# EAGLE design v2164_quad_VC_mixer_w_ext_in_0402 (EAGLE 7.7.0)
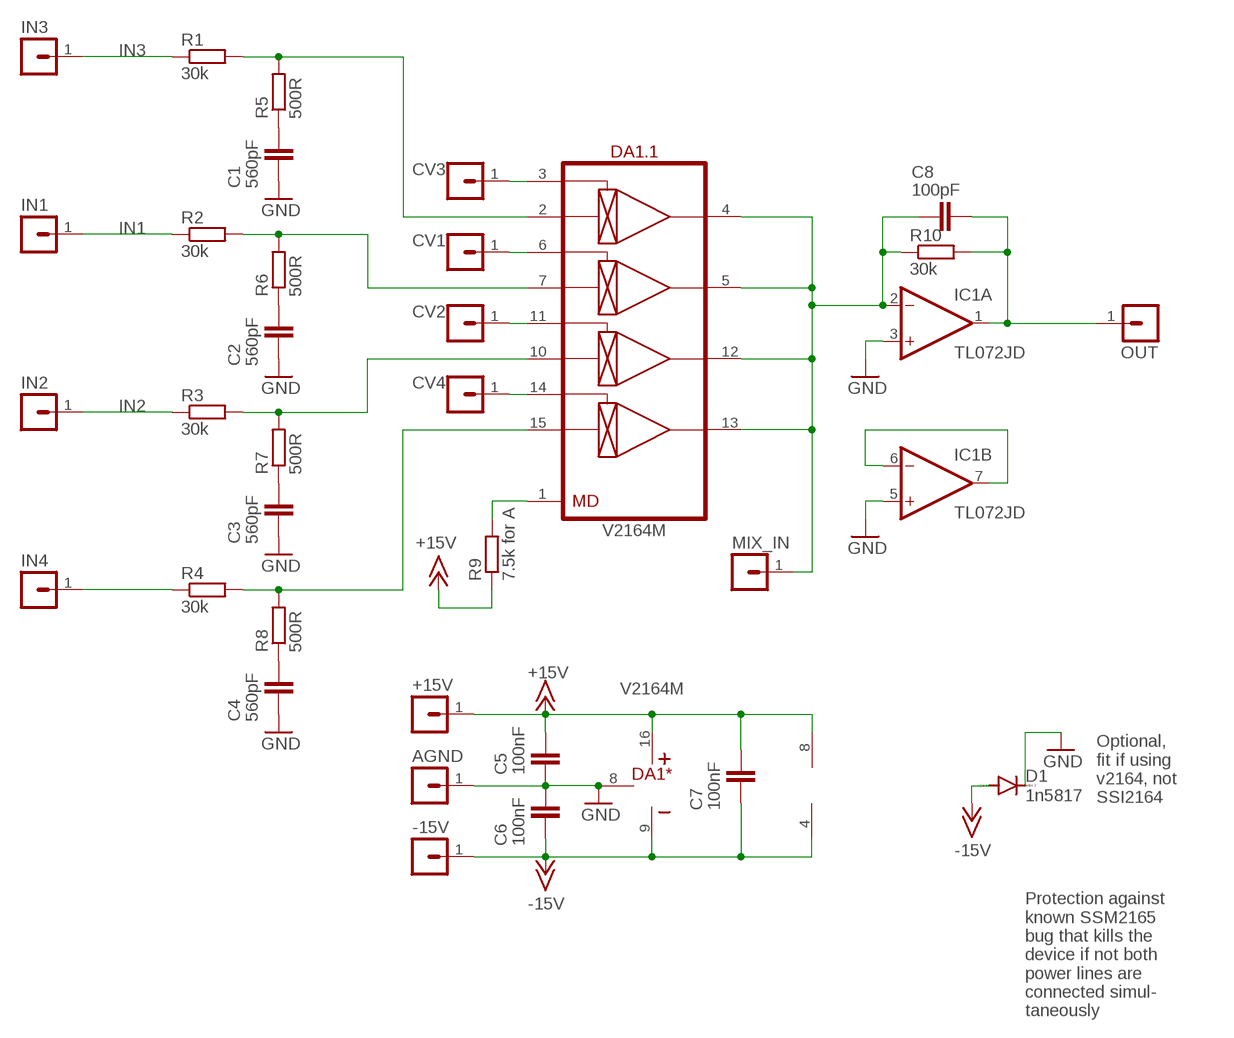
[diagram p0: schematic, sheet 1]

## Parts
+15V  MA01-1JN  [MA01N-1J]
-15V  MA01-1JN  [MA01N-1J]
AGND  MA01-1JN  [MA01N-1J]
C1  560pF  C-EUC0603  [C0603]
C2  560pF  C-EUC0603  [C0603]
C3  560pF  C-EUC0603  [C0603]
C4  560pF  C-EUC0603  [C0603]
C5  100nF  C-EUC0402  [C0402]
C6  100nF  C-EUC0402  [C0402]
C7  100nF  C-EUC0402  [C0402]
C8  100pF  C-EUC0402  [C0402]
CV1  MA01-1JN  [MA01N-1J]
CV2  MA01-1JN  [MA01N-1J]
CV3  MA01-1JN  [MA01N-1J]
CV4  MA01-1JN  [MA01N-1J]
D1  1n5817  DIODE-SOD323-R  [SOD323-R]
DA1  V2164M  [SO-16]
IC1  TL072JD  [SO08J]
IN1  MA01-1JN  [MA01N-1J]
IN2  MA01-1JN  [MA01N-1J]
IN3  MA01-1JN  [MA01N-1J]
IN4  MA01-1JN  [MA01N-1J]
MIX_IN  MA01-1JN  [MA01N-1J]
OUT  MA01-1JN  [MA01N-1J]
R1  30k  R-EU_R0402  [R0402]
R2  30k  R-EU_R0402  [R0402]
R3  30k  R-EU_R0402  [R0402]
R4  30k  R-EU_R0402  [R0402]
R5  500R  R-EU_R0402  [R0402]
R6  500R  R-EU_R0402  [R0402]
R7  500R  R-EU_R0402  [R0402]
R8  500R  R-EU_R0402  [R0402]
R9  7.5k for A  R-EU_R0402  [R0402]
R10  30k  R-EU_R0402  [R0402]

## Nets
+15V: +15V.1 C5.2 C7.2 DA1.16(*:V+) IC1.8(P:V+) R9.1
-15V: -15V.1 C6.1 C7.1 D1.A DA1.9(*:V-) IC1.4(P:V-)
CV1: CV1.1 DA1.6(.1:CV2)
CV2: CV2.1 DA1.11(.1:CV3)
CV4: CV4.1 DA1.14(.1:CV4)
CV5: CV3.1 DA1.3(.1:CV1)
GND: AGND.1 C1.1 C2.1 C3.1 C4.1 C5.1 C6.2 D1.C DA1.8(*:GND) IC1.3(A:+IN) IC1.5(B:+IN)
IN1: IN1.1 R2.1
IN2: IN2.1 R3.1
IN3: IN3.1 R1.1
IN4: IN4.1 R4.1
N$1: IC1.6(B:-IN) IC1.7(B:OUT)
N$2: DA1.1(.1:MD) R9.2
N$5: C8.1 DA1.4(.1:OUT1) DA1.5(.1:OUT2) DA1.12(.1:OUT3) DA1.13(.1:OUT4) IC1.2(A:-IN) MIX_IN.1 R10.1
N$9: C1.2 R5.1
N$10: C2.2 R6.1
N$11: C3.2 R7.1
N$12: C4.2 R8.1
N$17: DA1.2(.1:IN1) R1.2 R5.2
N$18: DA1.7(.1:IN2) R2.2 R6.2
N$19: DA1.10(.1:IN3) R3.2 R7.2
N$20: DA1.15(.1:IN4) R4.2 R8.2
OUT: C8.2 IC1.1(A:OUT) OUT.1 R10.2

## Notes on the sheet
- Optional,
  fit if using
  v2164, not
  SSI2164
- Protection against
  known SSM2165
  bug that kills the
  device if not both
  power lines are 
  connected simul-
  taneously

## Library data of the parts
+15V -15V AGND CV1-CV4 IN1-IN4 MIX_IN OUT = joakim:MA01-1J: PIN HEADER
C1-C8 = rcl:C-EU: CAPACITOR, European symbol; SPICEPREFIX: C
D1 = diode:DIODE-: DIODE
DA1 = ic-coolaudio:V2164
IC1 = joakim:TL072J: OP AMP
R1-R10 = rcl:R-EU_: RESISTOR, European symbol; SPICEPREFIX: R

## Board
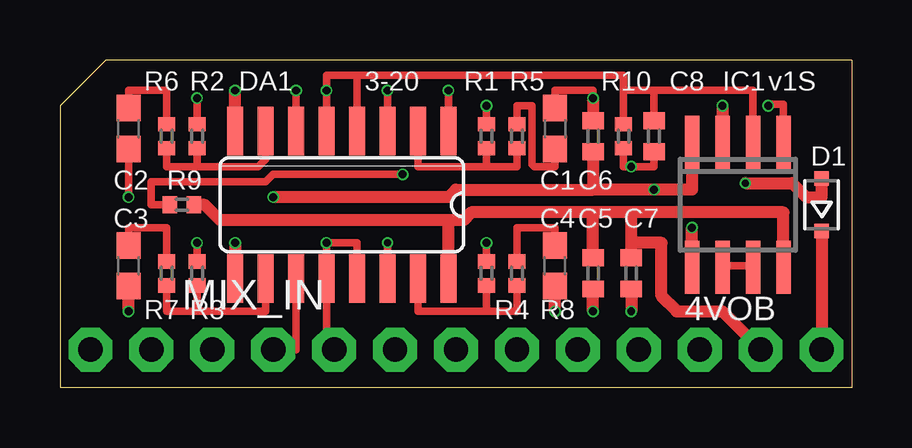
[diagram p1: board, top side]
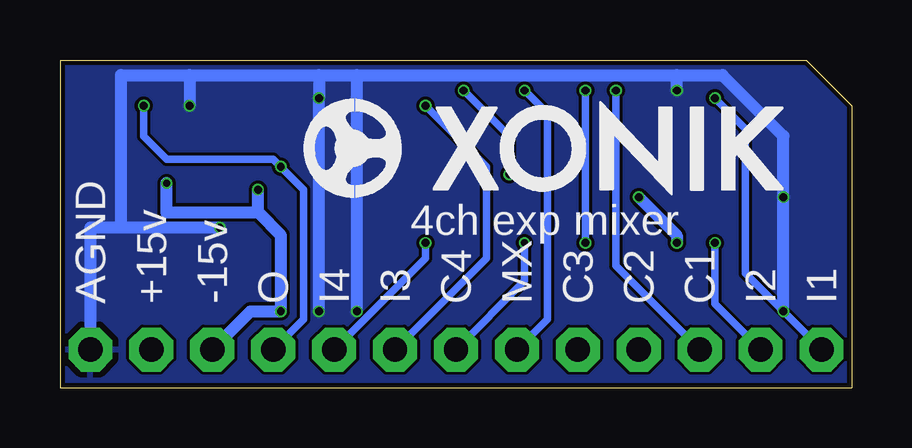
[diagram p2: board, bottom side, seen from below]

Size 33.02 x 13.65 mm. Coordinates in mm from the lower left corner, seen from the top.
Outline: 33.02,13.65 1.91,13.65 0,11.75 0,0 33.02,0 33.02,13.65
Copper layers (1*16): Top 0.035mm / dielectric 1.6mm / Bottom 0.035mm
Design rules "jlcpcb-2layers": minimum track width 5mil, minimum drill 0.3mm, track to track 5mil, track to pad 5mil, pad to pad 5mil, via to via 5mil, smd to smd 5mil, copper to edge 0.2mm, drill to drill 6mil, minimum pad ring 10mil, minimum via ring 3mil, stop-mask expansion 4mil, vias tented up to drill 0mil, thermal gap 10mil

### Footprints (pad centres in the part's own frame; a part is rotated, then mirrored left to right if it is on the bottom)
MA01N-1J = drill 1.016 octagon: 1 0,0
C0603 = smd 1.1 x 1: 1 -0.85,0; 2 0.85,0
C0402 = smd 0.7 x 0.9: 1 -0.65,0; 2 0.65,0
SOD323-R = smd 0.6 x 0.6: A 1.1,0; C -1.1,0
SO-16 = smd 0.66 x 2.032: 1 -4.445,-3.073; 2 -3.175,-3.073; 3 -1.905,-3.073; 4 -0.635,-3.073; 5 0.635,-3.073; 6 1.905,-3.073; 7 3.175,-3.073; 8 4.445,-3.073; 9 4.445,3.073; 10 3.175,3.073; 11 1.905,3.073; 12 0.635,3.073; 13 -0.635,3.073; 14 -1.905,3.073; 15 -3.175,3.073; 16 -4.445,3.073
SO08J = smd 0.6 x 2.2: 1 -1.905,-2.6; 2 -0.635,-2.6; 3 0.635,-2.6; 4 1.905,-2.6; 5 1.905,2.6; 6 0.635,2.6; 7 -0.635,2.6; 8 -1.905,2.6
R0402 = smd 0.6 x 0.7: 1 -0.5,0; 2 0.5,0

### Placement (x,y rotation side)
+15V  29.21,1.59 90 top
-15V  26.67,1.59 90 top
AGND  31.75,1.59 90 top
C1  20.64,10.79 270 top
C2  2.86,10.79 90 top
C3  2.86,5.08 90 top
C4  20.64,5.08 90 top
C5  22.23,4.76 90 top
C6  22.23,10.48 90 top
C7  23.81,4.76 90 top
C8  24.77,10.48 270 top
CV1  6.35,1.59 90 top
CV2  8.89,1.59 90 top
CV3  13.97,1.59 90 top
CV4  16.51,1.59 90 top
D1  31.75,7.62 90 top
DA1  11.75,7.62 180 top
IC1  28.26,7.62 180 top
IN1  1.27,1.59 90 top
IN2  3.81,1.59 90 top
IN3  19.05,1.59 90 top
IN4  21.59,1.59 90 top
MIX_IN  11.43,1.59 0 top
OUT  24.13,1.59 90 top
R1  17.78,10.48 270 top
R2  5.71,10.48 270 top
R3  5.71,4.76 270 top
R4  17.78,4.76 270 top
R5  19.05,10.48 270 top
R6  4.45,10.48 270 top
R7  4.45,4.76 270 top
R8  19.05,4.76 270 top
R9  5.08,7.62 180 top
R10  23.5,10.48 270 top
U$1  [XONIK_LOGO_20]  22.86,7.94 0 bottom

### Tracks (layer width: path | path; a pad name or v marks a point on that pad's centre or on a via)
+15V
  Top 0.508: 23.81,7.3 30.16,7.3 IC1.8 | 23.81,7.3 22.23,7.3 | 22.23,7.3 17.14,7.3 16.83,6.99 16.19,6.99 | C5.2 22.23,7.3 | DA1.16 16.19,6.99 | C7.2 23.81,6.03 | 23.81,6.03 23.81,7.3 | R9.1 6.03,7.62 6.67,6.99 16.19,6.99 | +15V.1 27.62,3.17 25.72,3.17 25.08,3.81 25.08,6.03 23.81,6.03
-15V  (via drill 0.3, 0.33)
  Top 0.508: IC1.4 26.35,8.26 v24.77,8.26 22.23,8.26 | 22.23,8.26 16.51,8.26 16.19,7.94 v8.89,7.94 | C6.1 22.23,8.26 | C7.1 v23.81,3.17 | v7.3,6.03 DA1.9 | v28.57,8.52 30.53,8.52 31.11,7.94 31.75,7.94 D1.A
  Bottom 0.508: 24.77,7.3 23.81,6.35 v23.81,3.17 25.08,3.17 -15V.1 | v8.89,7.94 7.3,6.35 v7.3,6.03 | v28.57,8.52 28.57,7.3 24.77,7.3 | 24.77,7.3 v24.77,8.26
CV1  (via drill 0.33)
  Top 0.305: DA1.6 v9.84,12.38
  Bottom 0.305: v9.84,12.38 9.84,5.08 CV1.1
CV2
  Top 0.305: CV2.1 9.84,1.59 DA1.11
CV4  (via drill 0.3)
  Top 0.305: 13.65,4.45 DA1.14 v13.65,6.03
  Bottom 0.305: CV4.1 13.65,4.45 v13.65,6.03
CV5  (via drill 0.33)
  Top 0.305: DA1.3 v13.65,12.38
  Bottom 0.305: v13.65,12.38 12.7,11.43 12.7,2.86 CV3.1
GND  (via drill 0.33)
  Top 0.305: C2.1 v2.86,7.94 | C1.1 20.64,12.38 22.23,12.38 v22.23,12.06
  Top 0.508: DA1.8 v7.3,12.38 | v22.23,12.06 C6.2 | v27.62,11.75 IC1.3 | v2.86,3.17 C3.1 | v20.64,3.17 C4.1 | v22.23,3.17 C5.1 | IC1.5 v26.35,6.67 | D1.C AGND.1
  Bottom 0.508: 27.62,13.02 30.48,13.02 30.48,6.67 | 27.62,13.02 22.23,13.02 | 22.23,13.02 20.64,13.02 | 20.64,13.02 7.3,13.02 | 7.3,13.02 5.4,13.02 2.86,10.48 v2.86,7.94 v2.86,3.17 | v7.3,12.38 7.3,13.02 | 22.23,13.02 v22.23,12.06 v22.23,3.17 | 27.62,13.02 v27.62,11.75 | v20.64,3.17 20.64,13.02 | AGND.1 31.75,6.67 30.48,6.67 | v26.35,6.67 30.48,6.67
  pour Bottom: 0,0 0,13.65 33.02,13.65 33.02,0
IN1  (via drill 0.33)
  Top 0.305: R2.1 v5.71,12.06
  Bottom 0.305: v5.71,12.06 4.45,10.79 4.45,4.76 IN1.1
IN2  (via drill 0.33)
  Top 0.305: R3.1 v5.71,6.03
  Bottom 0.305: v5.71,6.03 5.71,3.49 IN2.1
IN3  (via drill 0.33)
  Top 0.305: R1.1 v17.78,11.75
  Bottom 0.305: v17.78,11.75 15.24,9.21 15.24,5.4 IN3.1
IN4  (via drill 0.33)
  Top 0.305: R4.1 v17.78,6.03
  Bottom 0.305: IN4.1 17.78,5.4 v17.78,6.03
N$1
  Top 0.305: IC1.6 27.62,5.08 28.89,5.08 IC1.7
N$2  (via drill 0.33)
  Top 0.305: R9.2 3.81,7.62 3.81,8.57 8.57,8.57 8.89,8.89 v14.29,8.89 | v16.19,12.38 DA1.1
  Bottom 0.305: v14.29,8.89 14.29,10.48 v16.19,12.38
N$5  (via drill 0.33)
  Top 0.305: 24.77,12.38 23.5,12.38 | 23.5,12.38 R10.1 | C8.1 24.77,12.38 | IC1.2 28.89,12.38 24.77,12.38 | DA1.4 12.38,13.02 | 12.38,13.02 23.5,13.02 23.5,12.38 | 12.38,13.02 11.11,13.02 DA1.5 v11.11,12.38 | DA1.13 12.38,6.03 v11.11,6.03 DA1.12 11.11,1.91 MIX_IN.1
  Bottom 0.305: v11.11,12.38 v11.11,6.03
N$9
  Top 0.305: R5.1 19.05,11.75 19.68,11.75 19.68,9.31 19.79,9.21 20.64,9.21 C1.2
N$10
  Top 0.305: C2.2 2.86,12.38 4.45,12.38 R6.1
N$11
  Top 0.305: R7.1 4.45,6.67 2.86,6.67 C3.2
N$12
  Top 0.305: C4.2 20.64,6.67 19.05,6.67 R8.1
N$17
  Top 0.305: DA1.2 14.92,9.21 17.78,9.21 | R5.2 19.05,9.21 17.78,9.21 | 17.78,9.21 R1.2
N$18
  Top 0.305: R6.2 4.45,9.21 5.71,9.21 | 5.71,9.21 R2.2 | 5.71,9.21 8.26,9.21 8.57,9.53 DA1.7
N$19
  Top 0.305: R7.2 4.45,3.17 5.71,3.17 | 5.71,3.17 8.57,3.17 DA1.10 | R3.2 5.71,3.17
N$20
  Top 0.305: R8.2 19.05,3.17 17.78,3.17 | 17.78,3.17 14.92,3.17 DA1.15 | R4.2 17.78,3.17
OUT  (via drill 0.33)
  Top 0.305: R10.2 23.5,9.21 v23.81,9.21 24.77,9.21 C8.2 | IC1.1 30.16,11.81 29.59,11.81 v29.53,11.75
  Bottom 0.305: v29.53,11.75 29.53,10.48 28.57,9.53 24.13,9.53 v23.81,9.21 22.86,8.26 22.86,2.86 OUT.1

### Text on the board
tNames: 3-20 | v1S | 4VOB
bNames: 4ch exp mixer | I1 | I2 | C1 | C2 | C3 | MX | C4 | I3 | I4 | O | -15v | +15v | AGND